# Altium project monitor_panel.PrjPcb
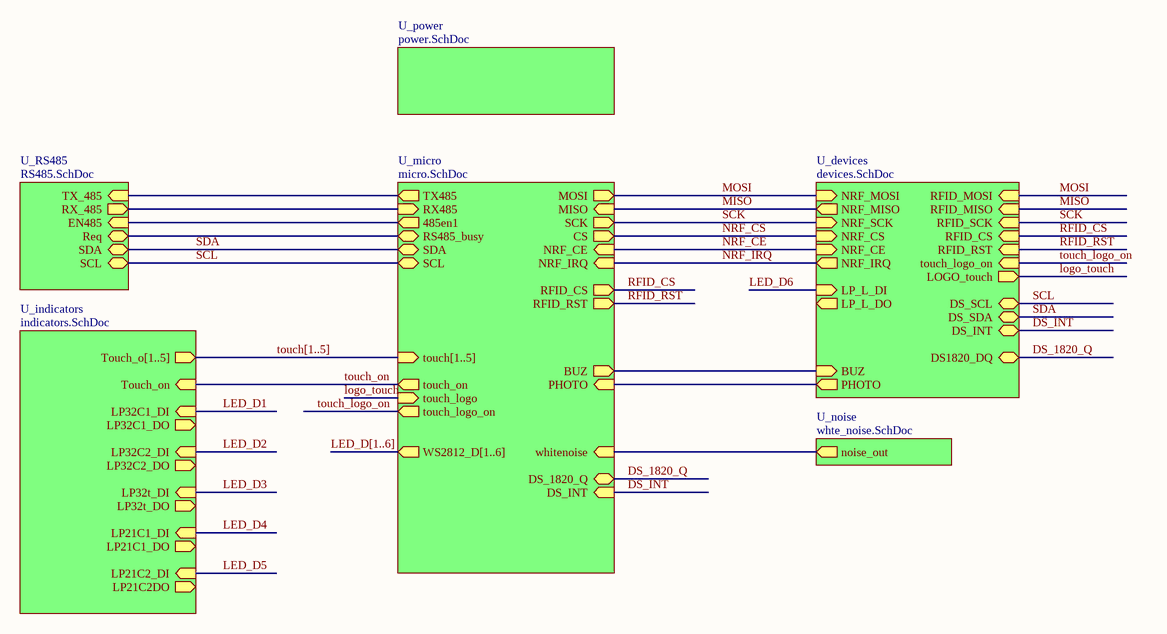
[diagram p0: top.SchDoc]
10 sheets, 211 parts. Net scope: hierarchical (ports join the sheet entries above them; power ports are global).
Board file: monitor_panel.PcbDoc
Sheets:
  top.SchDoc
    U_micro = micro.SchDoc
    U_devices = devices.SchDoc
    U_RS485 = RS485.SchDoc
    U_noise = whte_noise.SchDoc
    U_power = power.SchDoc
    U_indicators = indicators.SchDoc
      L1 = led_pack21.SchDoc
      L2 = led_pack21.SchDoc
      L3 = led_pack21.SchDoc
      L4 = led_pack21.SchDoc
      L5 = led_pack21.SchDoc
      L6 = led_pack21.SchDoc
      L7 = led_pack21.SchDoc
      L8 = led_pack21.SchDoc
      L9 = led_pack21.SchDoc
      L10 = led_pack21.SchDoc
      L11 = led_pack21.SchDoc
      L12 = led_pack21.SchDoc
      L13 = led_pack21.SchDoc
      L14 = led_pack21.SchDoc
      L15 = led_pack21.SchDoc
      M16 = led_pack32.SchDoc
      M17 = led_pack32.SchDoc
      M18 = led_pack32.SchDoc
      M19 = led_pack32.SchDoc
      M20 = led_pack32.SchDoc
      M21 = led_pack32.SchDoc
      M22 = led_pack32.SchDoc
      M23 = led_pack32.SchDoc
      M24 = led_pack32.SchDoc
      M25 = led_pack32.SchDoc
      T26 = led_pack32_touch.SchDoc
      T27 = led_pack32_touch.SchDoc
      T28 = led_pack32_touch.SchDoc
      T29 = led_pack32_touch.SchDoc
      T30 = led_pack32_touch.SchDoc

## Sheet top.SchDoc
size A4

### Sub-sheets
U_devices = devices.SchDoc: NRF_MISO (out), NRF_SCK (in), NRF_CE (in), NRF_IRQ (out), NRF_CS (in), NRF_MOSI (in), BUZ (in), PHOTO (out), DS_SCL (bidir), DS_SDA (bidir), DS_INT (bidir), DS1820_DQ (bidir), LOGO_touch (out), RFID_CS (in), RFID_MISO (in), RFID_RST (in), RFID_SCK (in), RFID_MOSI (in), LP_L_DI (in), LP_L_DO (out), touch_logo_on (in)
U_indicators = indicators.SchDoc: LP32C1_DI (in), LP21C1_DI (in), Touch_o[1..5] (out), LP32t_DO (out), LP32t_DI (in), LP32C1_DO (out), LP21C1_DO (out), Touch_on (in), LP21C2DO (out), LP32C2_DO (out), LP32C2_DI (in), LP21C2_DI (in)
U_micro = micro.SchDoc: whitenoise (in), SCL (bidir), SDA (bidir), RX485 (in), TX485 (out), 485en1 (out), RS485_busy (bidir), MOSI (out), MISO (in), SCK (out), CS (out), DS_INT (in), PHOTO (in), touch[1..5] (in), NRF_CE (in), NRF_IRQ (in), DS_1820_Q (bidir), BUZ (out), touch_on (out), touch_logo (in), WS2812_D[1..6] (out), RFID_CS (out), RFID_RST (out), touch_logo_on (out)
U_noise = whte_noise.SchDoc: noise_out (out)
U_power = power.SchDoc: no entries
U_RS485 = RS485.SchDoc: RX_485 (out), EN485 (in), TX_485 (in), Req (bidir), SDA (bidir), SCL (bidir)

### Nets
485en: sheet U_micro/485en1, sheet U_RS485/EN485
DS_1820_Q: sheet U_micro/DS_1820_Q, sheet U_devices/DS1820_DQ
DS_INT: sheet U_micro/DS_INT, sheet U_devices/DS_INT
logo_touch: sheet U_micro/touch_logo, sheet U_devices/LOGO_touch
MISO: sheet U_micro/MISO, sheet U_devices/NRF_MISO, sheet U_devices/RFID_MISO
MOSI: sheet U_micro/MOSI, sheet U_devices/NRF_MOSI, sheet U_devices/RFID_MOSI
NRF_CE: sheet U_micro/NRF_CE, sheet U_devices/NRF_CE
NRF_CS: sheet U_micro/CS, sheet U_devices/NRF_CS  [project net CS]
NRF_IRQ: sheet U_micro/NRF_IRQ, sheet U_devices/NRF_IRQ
photo: sheet U_micro/PHOTO, sheet U_devices/PHOTO
RFID_CS: sheet U_micro/RFID_CS, sheet U_devices/RFID_CS
RFID_RST: sheet U_micro/RFID_RST, sheet U_devices/RFID_RST
RS48_busy: sheet U_micro/RS485_busy, sheet U_RS485/Req
RX485: sheet U_micro/RX485, sheet U_RS485/RX_485
SCK: sheet U_micro/SCK, sheet U_devices/NRF_SCK, sheet U_devices/RFID_SCK
SCL: sheet U_micro/SCL, sheet U_devices/DS_SCL, sheet U_RS485/SCL
SDA: sheet U_micro/SDA, sheet U_devices/DS_SDA, sheet U_RS485/SDA
touch_logo_on: sheet U_micro/touch_logo_on, sheet U_devices/touch_logo_on
touch_on: sheet U_micro/touch_on, sheet U_indicators/Touch_on
TX485: sheet U_micro/TX485, sheet U_RS485/TX_485
whitenoise: sheet U_micro/whitenoise, sheet U_noise/noise_out
NetSP1_1: sheet U_micro/BUZ, sheet U_devices/BUZ

### Buses and harness runs
bus LED_D[1..6] = sheet U_micro/WS2812_D[1..6]
bus touch[1..5] = sheet U_indicators/Touch_o[1..5] = sheet U_micro/touch[1..5]

## Sheet micro.SchDoc
size A3
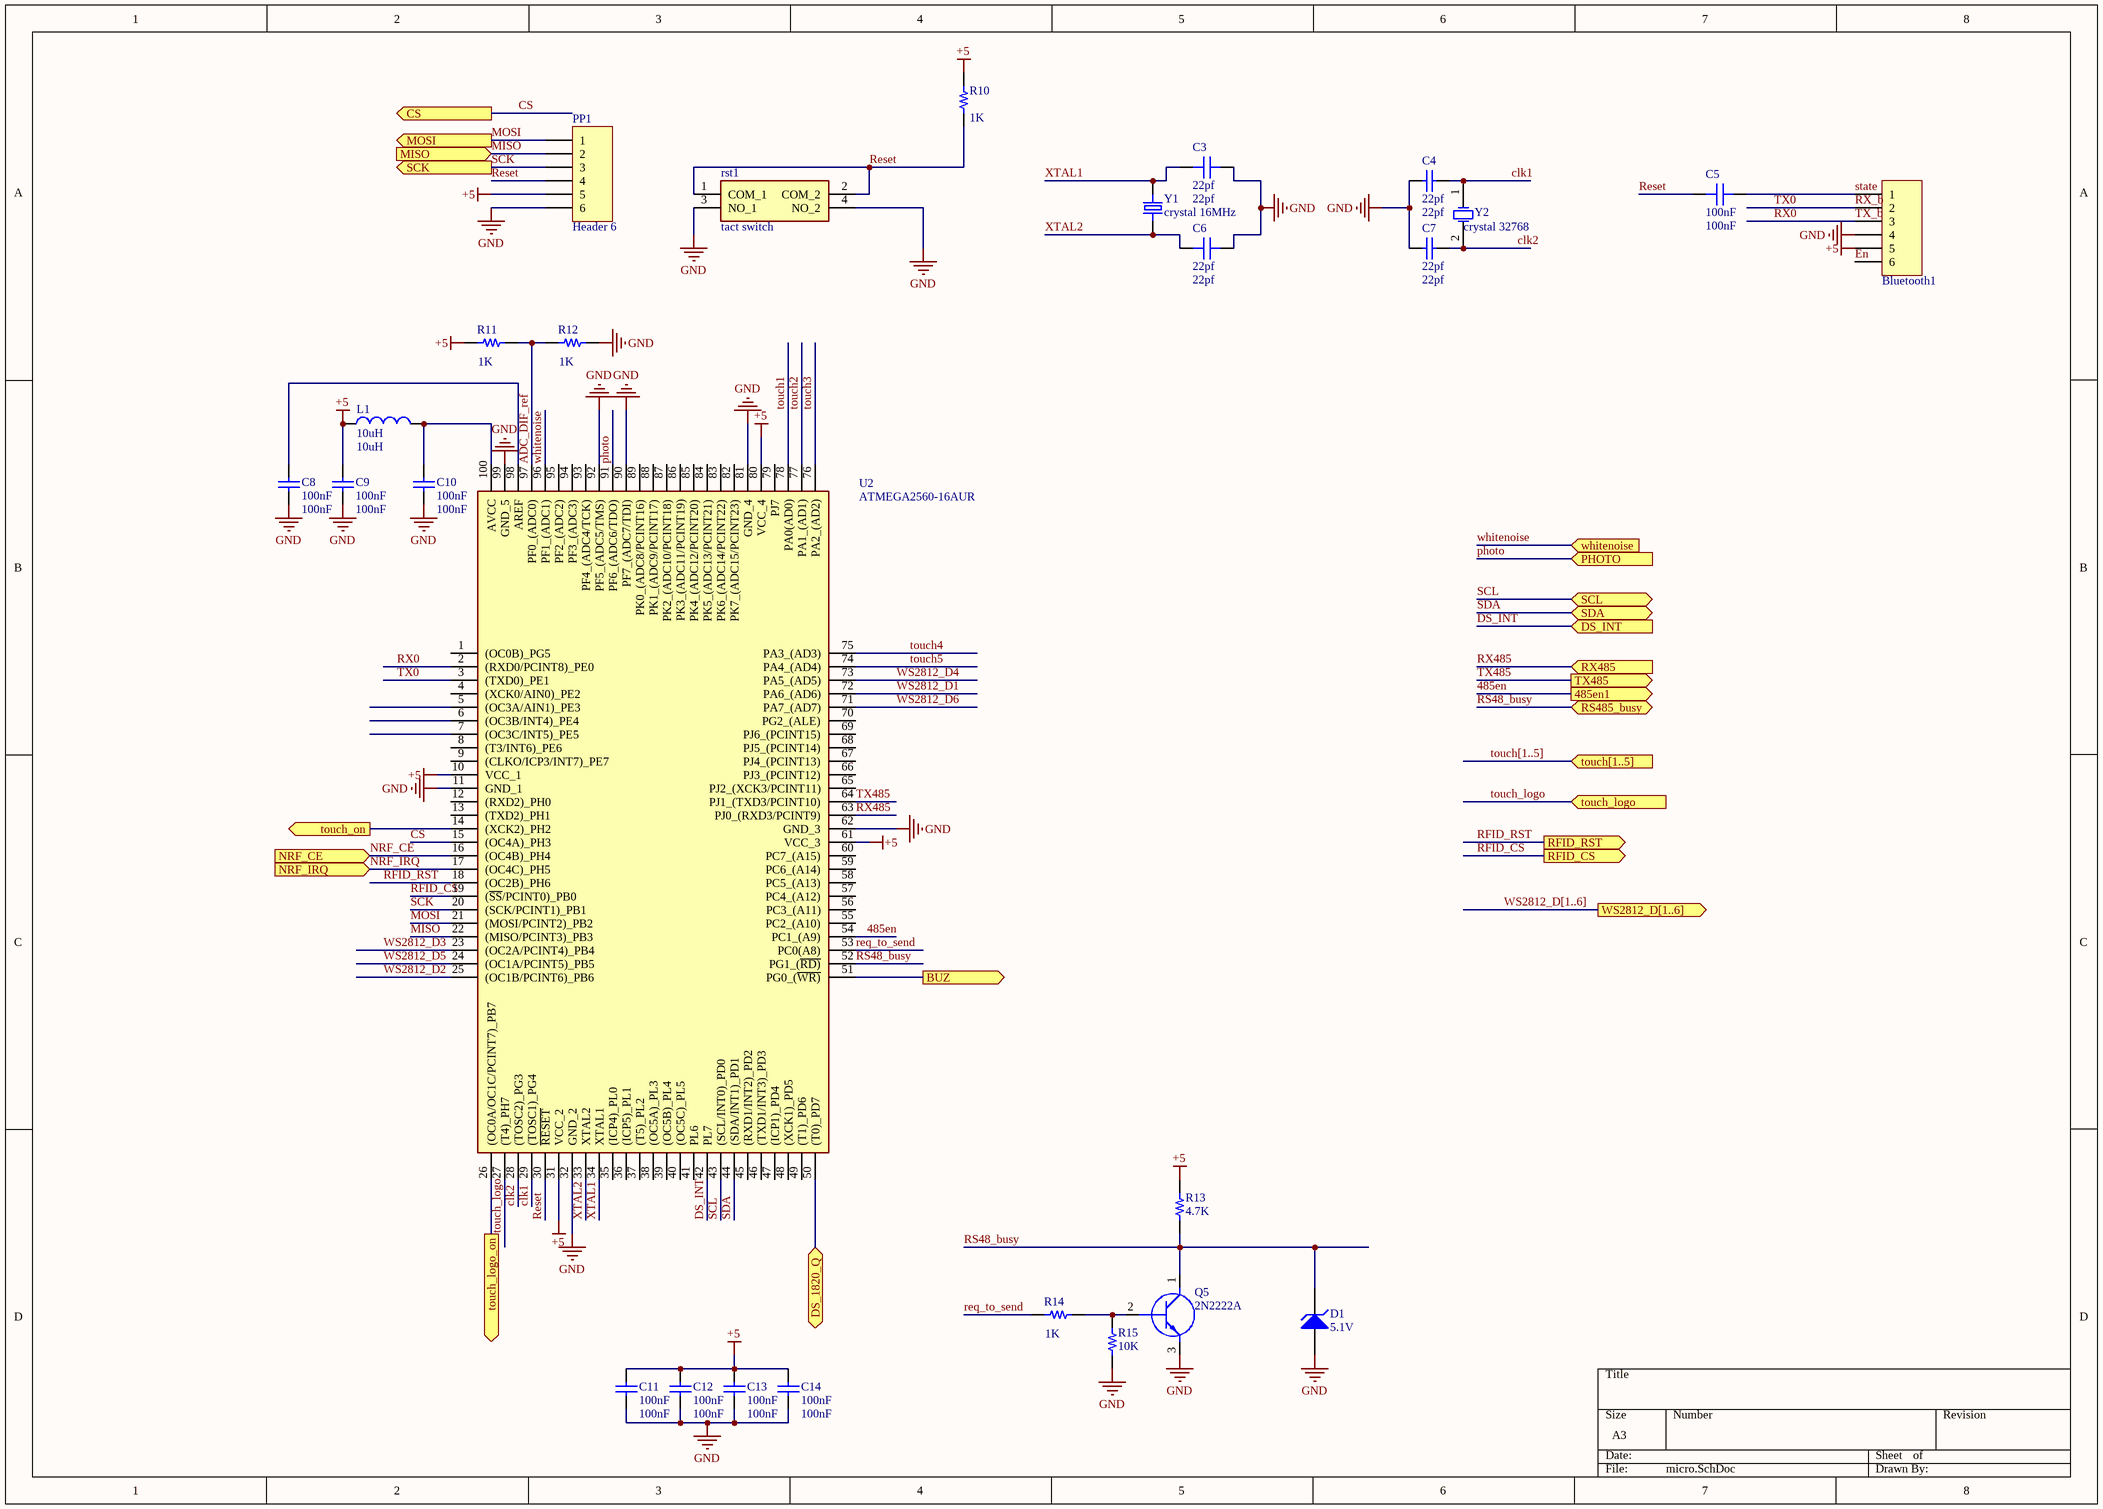
[diagram p1: micro.SchDoc]

### Parts
Bluetooth1  Header 6  [H-1x6]  (value not drawn)
C3  22pf  [0603C]
C4  22pf  [0603C]
C5  100nF  [0603C]
C6  22pf  [0603C]
C7  22pf  [0603C]
C8  100nF  [0603C]
C9  100nF  [0603C]
C10  100nF  [0603C]
C11  100nF  [0603C]
C12  100nF  [0603C]
C13  100nF  [0603C]
C14  100nF  [0603C]
D1  5.1V  [Diode 1n4148 SMD]
L1  10uH  [IND1206]
PP1  Header 6  [HDR1X6]
Q5  2N2222A  [soT95p280x130-3n]
R10  1K  [0603R]
R11  1K  [0603R]
R12  1K  [0603R]
R13  4.7K  [0603R]
R14  1K  [0603R]
R15  10K  [0603R]
rst1  tact switch  [DTSM63NVB]
U2  ATMEGA2560-16AUR  [QFP50P1600X1600X120-100N]
Y1  crystal 16MHz  [XTAL_ECS-180-S-5P-DN-TR]
Y2  crystal 32768  [XTAL RTC]

### Ports
485en1 (out), BUZ (out), CS (out), DS_1820_Q (bidir), DS_INT (in), MISO (in), MOSI (out), NRF_CE (in), NRF_IRQ (in), PHOTO (in), RFID_CS (out), RFID_RST (out), RS485_busy (bidir), RX485 (in), SCK (out), SCL (bidir), SDA (bidir), touch[1..5] (in), touch_logo (in), touch_logo_on (out), touch_on (out), TX485 (out), whitenoise (in), WS2812_D[1..6] (out)

### Nets
+5: Bluetooth1.5 C9.1 C11.1 C12.1 C13.1 C14.1 L1.1 PP1.5 R10.2 R11.2 R13.1 U2.10(VCC_1) U2.31(VCC_2) U2.61(VCC_3) U2.80(VCC_4)
GND: Bluetooth1.4 C3.1 C4.1 C6.1 C7.2 C8.2 C9.2 C10.2 C11.2 C12.2 C13.2 C14.2 D1.1(A) PP1.6 Q5.3(E) R12.1 R15.2 rst1.3(NO_1) rst1.4(NO_2) U2.11(GND_1) U2.32(GND_2) U2.62(GND_3) U2.81(GND_4) U2.90(PF7_(ADC7/TDI)) U2.92(PF5_(ADC5/TMS)) U2.99(GND_5)
485en: U2.54(PC1_(A9)) ; port 485en1
ADC_DIF_ref: R11.1 R12.2 U2.97(PF0_(ADC0))
clk1: C4.2 U2.29((TOSC1)_PG4) Y2.1(OSC1)
clk2: C7.1 U2.28((TOSC2)_PG3) Y2.2(OSC2)
CS: U2.15((OC4A)_PH3) ; port CS
DS_1820_Q: U2.50((T0)_PD7) ; port DS_1820_Q
DS_INT: U2.42(PL7) ; port DS_INT
En: Bluetooth1.6
MISO: PP1.2 U2.22((MISO/PCINT3)_PB3) ; port MISO
MOSI: PP1.1 U2.21((MOSI/PCINT2)_PB2) ; port MOSI
NRF_CE: U2.16((OC4B)_PH4) ; port NRF_CE
NRF_IRQ: U2.17((OC4C)_PH5) ; port NRF_IRQ
photo: U2.91(PF6_(ADC6/TDO)) ; port PHOTO
req_to_send: R14.2 U2.53(PC0(A8))
Reset: C5.2 PP1.4 R10.1 rst1.1(COM_1) rst1.2(COM_2) U2.30(~{RESET})
RFID_CS: U2.19((~{SS}/PCINT0)_PB0) ; port RFID_CS
RFID_RST: U2.18((OC2B)_PH6) ; port RFID_RST
RS48_busy: D1.2(K) Q5.1(C) R13.2 U2.52(PG1_(~{RD)}) ; port RS485_busy
RX0: Bluetooth1.3 U2.2((RXD0/PCINT8)_PE0)  [also labelled TX_b]
RX485: U2.63(PJ0_(RXD3/PCINT9)) ; port RX485
RX_b: Bluetooth1.2 U2.3((TXD0)_PE1)  [also labelled TX0]
SCK: PP1.3 U2.20((SCK/PCINT1)_PB1) ; port SCK
SCL: U2.43((SCL/INT0)_PD0) ; port SCL
SDA: U2.44((SDA/INT1)_PD1) ; port SDA
state: Bluetooth1.1 C5.1
touch1: U2.78(PA0(AD0))
touch2: U2.77(PA1_(AD1))
touch3: U2.76(PA2_(AD2))
touch4: U2.75(PA3_(AD3))
touch5: U2.74(PA4_(AD4))
touch_logo: U2.27((T4)_PH7) ; port touch_logo  [project net logo_touch]
touch_logo_on: U2.26((OC0A/OC1C/PCINT7)_PB7) ; port touch_logo_on
touch_on: U2.14((XCK2)_PH2) ; port touch_on
TX485: U2.64(PJ1_(TXD3/PCINT10)) ; port TX485
whitenoise: U2.96(PF1_(ADC1)) ; port whitenoise
WS2812_D1: U2.72(PA6_(AD6))  [project net LED_D1]
WS2812_D2: U2.25((OC1B/PCINT6)_PB6)  [project net LED_D2]
WS2812_D3: U2.23((OC2A/PCINT4)_PB4)  [project net LED_D3]
WS2812_D4: U2.73(PA5_(AD5))  [project net LED_D4]
WS2812_D5: U2.24((OC1A/PCINT5)_PB5)  [project net LED_D5]
WS2812_D6: U2.71(PA7_(AD7))  [project net LED_D6]
XTAL1: C3.2 U2.34(XTAL1) Y1.2
XTAL2: C6.2 U2.33(XTAL2) Y1.1
NetC8_1: C8.1 U2.98(AREF)
NetC10_1: C10.1 L1.2 U2.100(AVCC)
NetQ5_2: Q5.2(B) R14.1 R15.1
NetSP1_1: U2.51(PG0_(~{WR)}) ; port BUZ

Not connected (* = marked no-connect by the designer): U2 1((OC0B)_PG5) 4((XCK0/AIN0)_PE2) 5((OC3A/AIN1)_PE3) 6((OC3B/INT4)_PE4) 7((OC3C/INT5)_PE5) 8((T3/INT6)_PE6) 9((CLKO/ICP3/INT7)_PE7) 12((RXD2)_PH0) 13((TXD2)_PH1) 35((ICP4)_PL0) 36((ICP5)_PL1) 37((T5)_PL2) 38((OC5A)_PL3) 39((OC5B)_PL4) 40((OC5C)_PL5) 41(PL6) 45((RXD1/INT2)_PD2) 46((TXD1/INT3)_PD3) 47((ICP1)_PD4) 48((XCK1)_PD5) 49((T1)_PD6) 55(PC2_(A10)) 56(PC3_(A11)) 57(PC4_(A12)) 58(PC5_(A13)) 59(PC6_(A14)) 60(PC7_(A15)) 65(PJ2_(XCK3/PCINT11)) 66(PJ3_(PCINT12)) 67(PJ4_(PCINT13)) 68(PJ5_(PCINT14)) 69(PJ6_(PCINT15)) 70(PG2_(ALE)) 79(PJ7) 82(PK7_(ADC15/PCINT23)) 83(PK6_(ADC14/PCINT22)) 84(PK5_(ADC13/PCINT21)) 85(PK4_(ADC12/PCINT20)) 86(PK3_(ADC11/PCINT19)) 87(PK2_(ADC10/PCINT18)) 88(PK1_(ADC9/PCINT17)) 89(PK0_(ADC8/PCINT16)) 93(PF4_(ADC4/TCK)) 94(PF3_(ADC3)) 95(PF2_(ADC2))

### Buses and harness runs
bus touch[1..5] = port touch[1..5]
bus WS2812_D[1..6] = port WS2812_D[1..6]

### Library data of the parts
Bluetooth1 = H-1x6: Header, 6-Pin , female
C3 C5 C6 = Capacitor: CAP SMD 0603; Part Number: C0805X106K9RAC7800
  C3 C6: Value: 22pf
  C5: Value: 100nF
C4 C7-C14 = Cap: CAP SMD 0603; Published: 8-Jun-2000; LatestRevisionDate: 17-Jul-2002; LatestRevisionNote: Re-released for DXP Platform.; PackageReference: RAD-0.3; Publisher: Altium Limited; PackageDescription: Radial Cap, Thru-Hole; 2 Leads; 0.3 in Pin Spacing
  C4 C7: Value: 22pf
  C8-C14: Value: 100nF
D1 = D Zener: Zener Diode 5.1v; Published: 8-Jun-2000; LatestRevisionDate: 17-Jul-2002; LatestRevisionNote: Re-released for DXP Platform.; PackageReference: DIODE-0.7; Publisher: Altium Limited; PackageDescription: Diode, Thru-Hole; 2 Leads; 0.7 in Pin Spacing
L1 = Inductor: Inductor 1206; Code_IEC: 1005; Published: 8-Jun-2000; LatestRevisionDate: 29-May-2009; LatestRevisionNote: IPC-7351 Footprint Added.; PackageReference: 0402-A; Publisher: Altium Limited; PackageDescription: Chip Inductor; Code_JEITA: 0402; Value: 10uH
PP1 = Header 6: Header, 6-Pin , female; LatestRevisionDate: 17-Jul-2002; LatestRevisionNote: Re-released for DXP Platform.; Publisher: Altium Limited
Q5 = 2N2222A: Transistor BJT NPN SMD; pin to pad: 1>3 2>1 3>2; Manufacturer_Name: Foshan Blue Rocket Elec; Datasheet Link: https://datasheet.lcsc.com/szlcsc/1901291437_Foshan-Blue-Rocket-Elec-2N2222A_C358533.pdf; Height: 4.7mm; Manufacturer_Part_Number: 2N2222A
R10-R15 = Resistor: RES SMD 0603; Part Number: RCS0805100KFKEA
  R10-R12 R14: Value: 1K
  R13: Value: 4.7K
  R15: Value: 10K
rst1 = DTSM-66R-V-T_R: Push Button SMD - 4PIN; Manufacturer_Name: Diptronics; Manufacturer_Part_Number: DTSM-66R-V-T/R; Datasheet Link: https://www.mouser.co.uk/datasheet/2/910/464_DTSMJ-6-1571536.pdf; Height: 7.1mm; Mouser Part Number: 113-DTSM66RVTR; Mouser Price/Stock: https://www.mouser.co.uk/ProductDetail/Diptronics/DTSM-66R-V-T-R?qs=MLItCLRbWsxl2%252BVY862AIw%3D%3D
U2 = ATMEGA2560-16AUR: ATMEGA2560-LQFP100; Manufacturer_Name: Microchip; Datasheet Link: http://ww1.microchip.com/downloads/en/DeviceDoc/Atmel-2549-8-bit-AVR-Microcontroller-ATmega640-1280-1281-2560-2561_datasheet.pdf; Height: 1.2mm; Manufacturer_Part_Number: ATMEGA2560-16AUR; Mouser Part Number: 556-ATMEGA2560-16AUR; Mouser Price/Stock: https://www.mouser.co.uk/ProductDetail/Microchip-Technology-Atmel/ATMEGA2560-16AUR?qs=6Dg1WZIWLC5tcX5fO8xzXQ%3D%3D; Arrow Part Number: ATMEGA2560-16AUR; Arrow Price/Stock: https://www.arrow.com/en/products/atmega2560-16aur/microchip-technology?region=nac
Y1 = ECS-180-S-5P-DN-TR: Crystals 16MHz; MF: ECS International; MP: ECS-180-S-5P-DN-TR; Value: 16MHz; SnapEDA_Link: https://www.snapeda.com/parts/ECS-180-S-5P-DN-TR/ECS%20International/view-part/2547669/?ref=snap; Price: None; Package: HC49/US ECS International; Availability: Unavailable
Y2 = XTAL: RTC crystal; Company: E.P.I.L; Value: 32768; Design Date: 11/04/2011

## Sheet devices.SchDoc
size A3
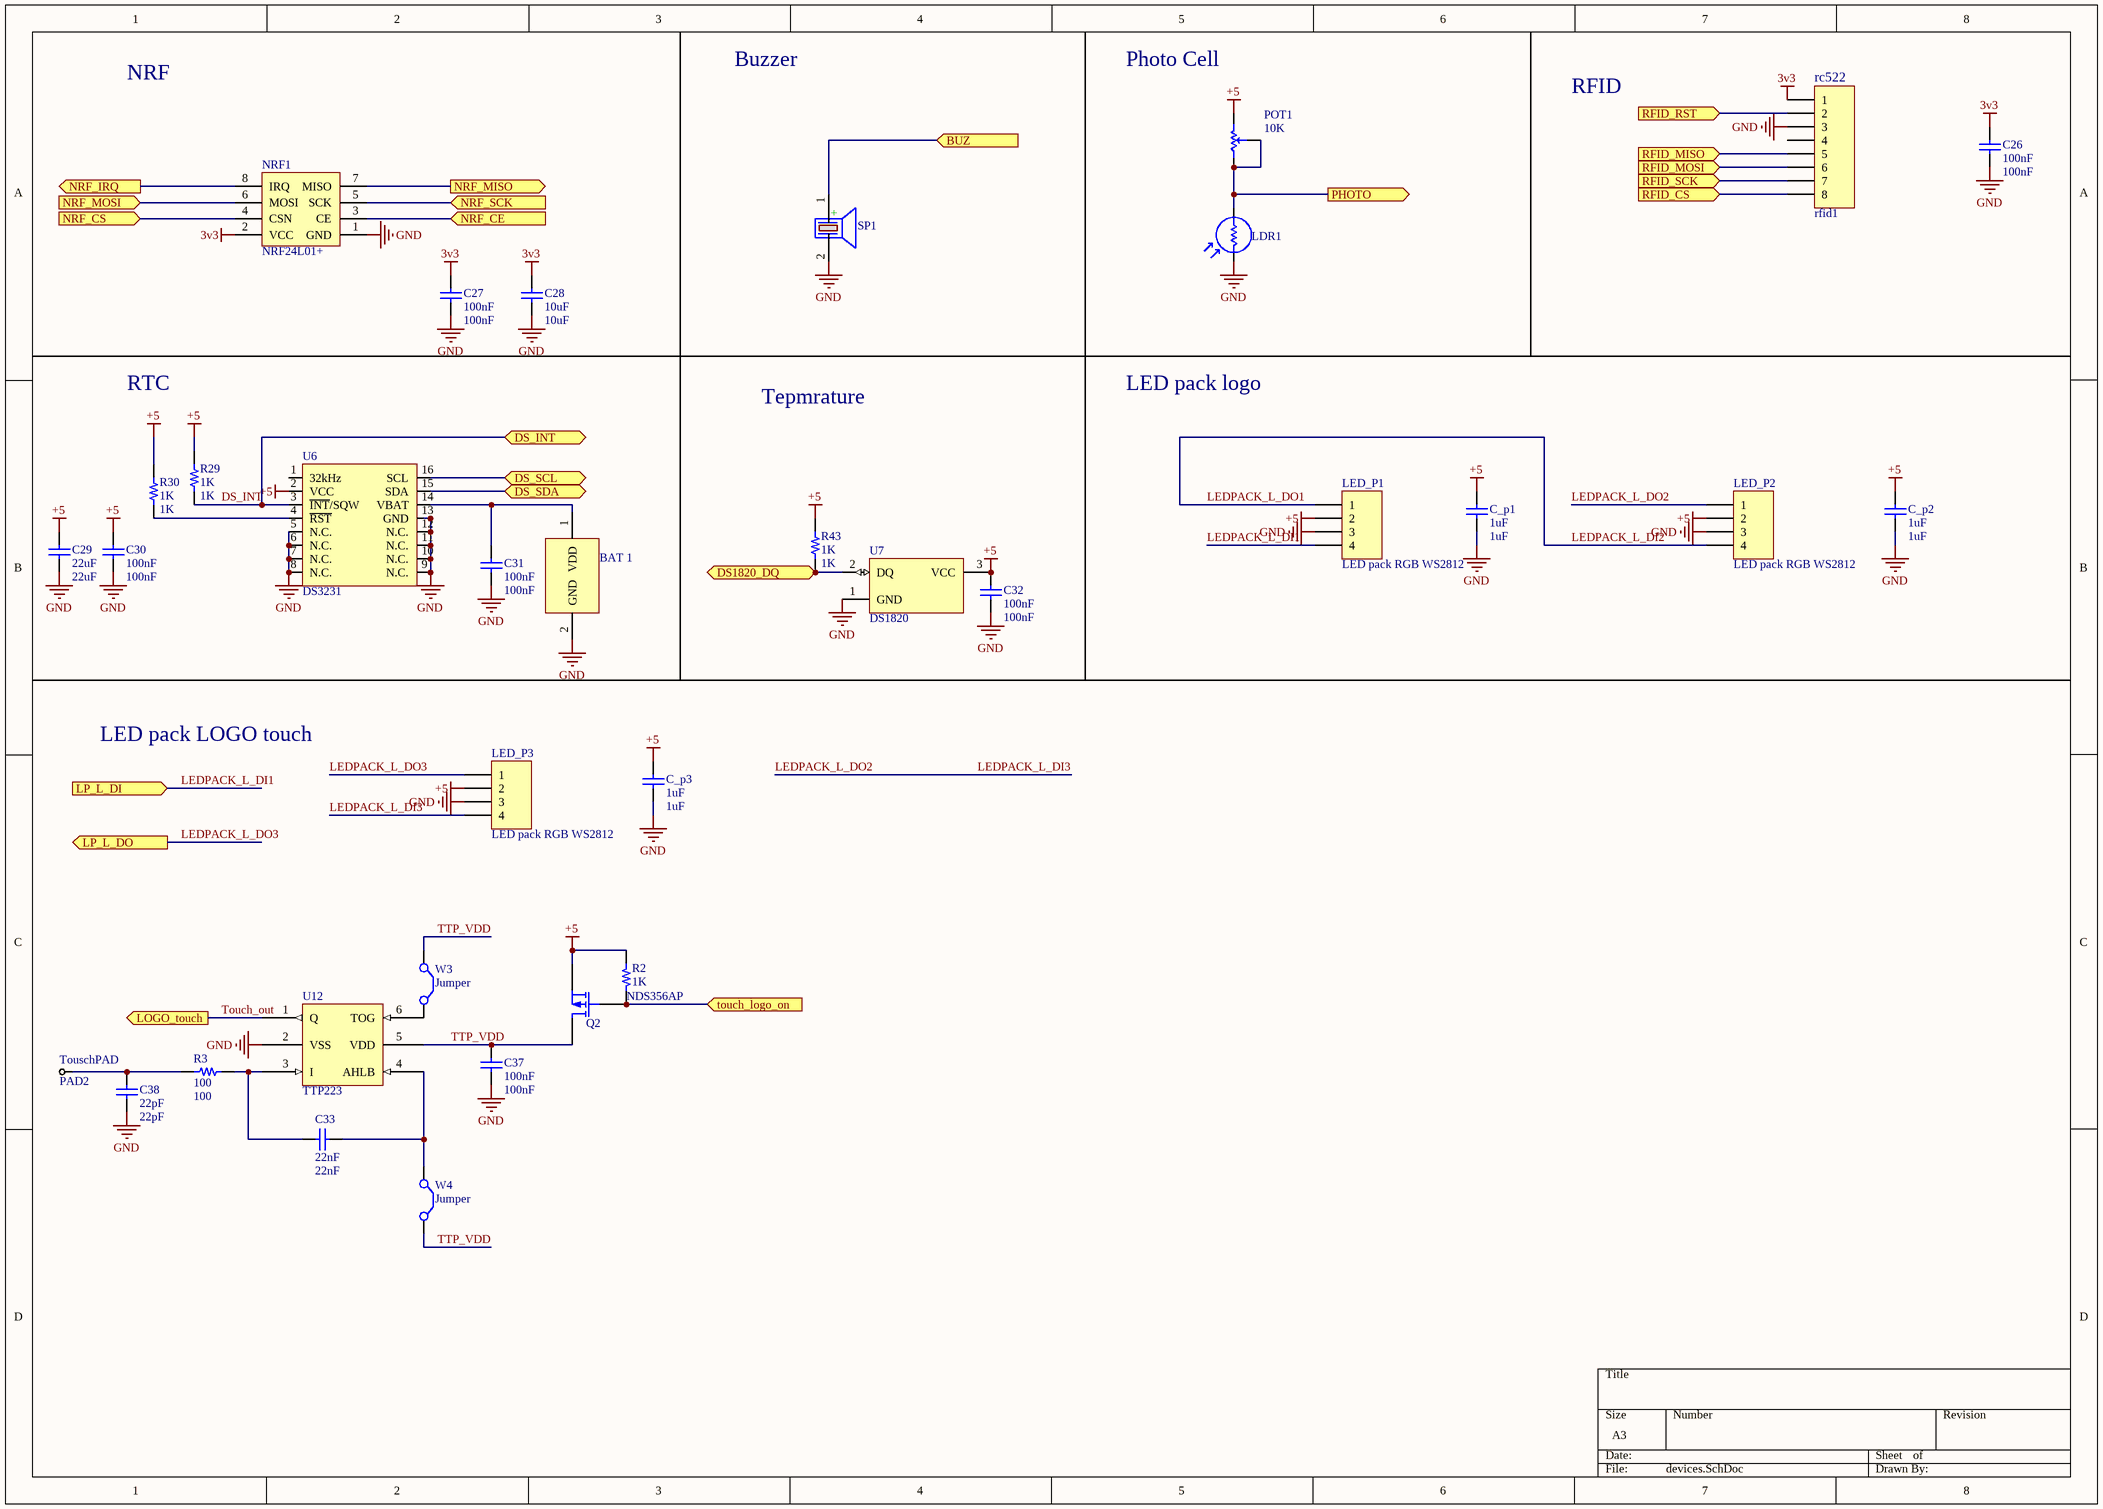
[diagram p2: devices.SchDoc]

### Parts
BAT_1  BAT Backup  [BATTERY_coin]  (value not drawn)
C26  100nF  [0603C]
C27  100nF  [0603C]
C28  10uF  [0603C]
C29  22uF  [0603C]
C30  100nF  [0603C]
C31  100nF  [0603C]
C32  100nF  [0603C]
C33  22nF  [0603C]
C37  100nF  [0603C]
C38  22pF  [0603C]
C_p1  1uF  [0603C]
C_p2  1uF  [0603C]
C_p3  1uF  [0603C]
LDR1  PhotoCell-5mm  [PhotoCell]  (value not drawn)
LED_P1  LED pack RGB WS2812  [PACK77-2121]  (no BOM)
LED_P2  LED pack RGB WS2812  [PACK95.4-2121]  (no BOM)
LED_P3  LED pack RGB WS2812  [pack21-2121]  (no BOM)
NRF1  NRF24L01+  [NRF24L01P]
PAD2  TouschPAD  [touchPAD3]  (no BOM)
POT1  10K  [POT 2]
Q2  NDS356AP  [soT95p280x130-3n]
R2  1K  [0603R]
R3  100  [0603R]
R29  1K  [0603R]
R30  1K  [0603R]
R43  1K  [0603R]
rfid1  H-1x8  [RCC522-rfID-2]  (value not drawn)
SP1  BUZZER  [BUZZER 7.62mm DC]  (value not drawn)
U6  DS3231  [SO-16W]
U7  DS1820  [DS1820]
U12  TTP223  [SOT23-6_L]
W3  Jumper  [JUMPER]  (no BOM)
W4  Jumper  [JUMPER]  (no BOM)

### Ports
BUZ (in), DS1820_DQ (bidir), DS_INT (bidir), DS_SCL (bidir), DS_SDA (bidir), LOGO_touch (out), LP_L_DI (in), LP_L_DO (out), NRF_CE (in), NRF_CS (in), NRF_IRQ (out), NRF_MISO (out), NRF_MOSI (in), NRF_SCK (in), PHOTO (out), RFID_CS (in), RFID_MISO (in), RFID_MOSI (in), RFID_RST (in), RFID_SCK (in), touch_logo_on (in)

### Nets
3v3: C26.2 C27.2 C28.2 NRF1.2(VCC) rfid1.1
+5: C29.2 C30.2 C32.2 C_p1.2 C_p2.2 C_p3.2 LED_P1.2 LED_P2.2 LED_P3.2 POT1.2(CW) Q2.3(S) R2.1 R29.2 R30.2 R43.2 U6.2(VCC) U7.3(VCC)
GND: BAT_1.2(GND) C26.1 C27.1 C28.1 C29.1 C30.1 C31.1 C32.1 C37.1 C38.1 C_p1.1 C_p2.1 C_p3.1 LDR1.1 LED_P1.3 LED_P2.3 LED_P3.3 NRF1.1(GND) rfid1.3 SP1.2(-) U6.5(N.C.) U6.6(N.C.) U6.7(N.C.) U6.8(N.C.) U6.9(N.C.) U6.10(N.C.) U6.11(N.C.) U6.12(N.C.) U6.13(GND) U7.1(GND) U12.2(VSS)
CS: NRF1.4(CSN) ; port NRF_CS
DS_1820_Q: R43.1 U7.2(DQ) ; port DS1820_DQ
DS_INT: R29.1 U6.3(~{INT}/SQW) ; port DS_INT
LEDPACK_L_DI1: LED_P1.4 ; port LP_L_DI  [project net LED_D6]
LEDPACK_L_DI2: LED_P1.1 LED_P2.4  [also labelled LEDPACK_L_DO1]
LEDPACK_L_DI3: LED_P2.1 LED_P3.4  [also labelled LEDPACK_L_DO2]
LEDPACK_L_DO3: LED_P3.1 ; port LP_L_DO
MISO: NRF1.7(MISO) rfid1.5 ; port NRF_MISO, port RFID_MISO
MOSI: NRF1.6(MOSI) rfid1.6 ; port NRF_MOSI, port RFID_MOSI
NRF_CE: NRF1.3(CE) ; port NRF_CE
NRF_IRQ: NRF1.8(IRQ) ; port NRF_IRQ
photo: LDR1.2 POT1.1(CCW) POT1.3(SetPoint) ; port PHOTO
RFID_CS: rfid1.8 ; port RFID_CS
RFID_RST: rfid1.2 ; port RFID_RST
SCK: NRF1.5(SCK) rfid1.7 ; port NRF_SCK, port RFID_SCK
SCL: U6.16(SCL) ; port DS_SCL
SDA: U6.15(SDA) ; port DS_SDA
touch_logo_on: Q2.2(G) R2.2 ; port touch_logo_on
Touch_out: U12.1(Q) ; port LOGO_touch  [project net logo_touch]
TTP_VDD: C37.2 Q2.1(D) U12.5(VDD) W3.1(C1) W4.2(C2)
NetBAT_1_1: BAT_1.1(VDD) C31.2 U6.14(VBAT)
NetC33_1: C33.1 U12.4(AHLB) W4.1(C1)
NetC33_2: C33.2 R3.1 U12.3(I)
NetC38_2: C38.2 PAD2.1(T) R3.2
NetR30_1: R30.1 U6.4(~{RST})
NetSP1_1: SP1.1(+) ; port BUZ
NetU12_6: U12.6(TOG) W3.2(C2)

Not connected (* = marked no-connect by the designer): rfid1 4; U6 1(32kHz)

### Notes on the sheet
- NRF
- Buzzer
- Photo Cell
- RFID
- (near rfid1) rc522
- RTC
- Tepmrature
- LED pack logo
- LED pack LOGO touch

### Library data of the parts
BAT_1 = BAT Backup: COIN CELL BATTERY CR1220
C26-C32 C37 C_p1-C_p3 = Cap: CAP SMD 0603; Published: 8-Jun-2000; LatestRevisionDate: 17-Jul-2002; LatestRevisionNote: Re-released for DXP Platform.; PackageReference: RAD-0.3; Publisher: Altium Limited; PackageDescription: Radial Cap, Thru-Hole; 2 Leads; 0.3 in Pin Spacing
  C26 C27 C30-C32 C37: Value: 100nF
  C28: Value: 10uF
  C29: Value: 22uF
  C_p1-C_p3: Value: 1uF
C33 C38 = Cap: X7R_NPO; Published: 8-Jun-2000; LatestRevisionDate: 17-Jul-2002; LatestRevisionNote: Re-released for DXP Platform.; PackageReference: RAD-0.3; Publisher: Altium Limited; PackageDescription: Radial Cap, Thru-Hole; 2 Leads; 0.3 in Pin Spacing
  C33: Value: 22nF
  C38: Value: 22pF
LDR1 = LDR: Photo Cell- Variable Resistor With Light; Company: IPA CO.; Designer: Saeid Jorablo; Last Update Time: 2008/07/17
LED_P1 = Header 4: 19RGB LED pack; LatestRevisionDate: 17-Jul-2002; LatestRevisionNote: Re-released for DXP Platform.; Publisher: Altium Limited
LED_P2 = Header 4: 23 RGB LED pack; LatestRevisionDate: 17-Jul-2002; LatestRevisionNote: Re-released for DXP Platform.; Publisher: Altium Limited
LED_P3 = Header 4: 5 RGB LED pack; LatestRevisionDate: 17-Jul-2002; LatestRevisionNote: Re-released for DXP Platform.; Publisher: Altium Limited
NRF1 = NRF24L01P: NRF Module; Ali Hafizi: Creature
PAD2 = Test Point
POT1 = POT: Variable Resistor; Value: 10K
Q2 = MOSFET-P: P-Channel MOSFET SOT23; pin to pad: 1>3 2>1 3>2; Published: 8-Jun-2000; LatestRevisionDate: 17-Jul-2002; LatestRevisionNote: Re-released for DXP Platform.; PackageVersion: 1995/1996; PackageReference: E3; Publisher: Altium Limited; PackageDescription: TO, Flat Index; 3 In-Line, Axial Leads; Body Dia. 4.6mm; Lead Dia. 0.5 mm (max)
R2 R3 R29 R30 R43 = Resistor: as R10 on sheet micro
  R2 R29 R30 R43: Value: 1K
  R3: Value: 100
SP1 = PIEZO BUZZER: PIEZO BUZZER 5VOLTS; Designer: Abbas Basereh; Comment_1: SPEAKER AND BEEP; Design Date: 1395/11/14; ComponentLink2Description: Reference; PackageDescription: THD; Publisher: Abbas Basereh; Mounting Technology: THD; Pin Count: 2; Status: Unreleased
U6 = DS3231: DS3231 RTC
U7 = DS1820: 1-Wire Digital Thermometer; ComponentAvailability: Obsolete; Published: 13-Oct-2000; LatestRevisionDate: 17-Jul-2002; LatestRevisionNote: Re-released for DXP Platform.; DatasheetVersion: 5-Mar-1998; PackageVersion: 1999; PackageReference: PR35; Publisher: Altium Limited; PackageDescription: TO, Flat Index; 3 In-Line, Axial Leads; Body Dia. 4.6mm; Leads 0.56 x 0.51 mm (max); ComponentLink1Description: Manufacturer Link; ComponentLink1URL: http://www.maxim-ic.com/; ComponentLink2Description: Datasheet; ComponentLink2URL: http://pdfserv.maxim-ic.com/en/ds/DS1820-DS1820S.pdf; ComponentLink3Description: Discontinuation Notice; ComponentLink3URL: http://www.maxim-ic.com/qa/pdfs/non-obsolescence-letter.pdf
U12 = ttp223b: capacitive touch IC
W3 W4 = Jumper: Jumper Wire; Published: 24-Mar-1999; LatestRevisionDate: 17-Jul-2002; LatestRevisionNote: Re-released for DXP Platform.; PackageReference: RAD-0.2; Publisher: Altium Limited; PackageDescription: Radial Cap, Thru-Hole; 2 Leads; 0.2 in Pin Spacing

## Sheet RS485.SchDoc
size A4
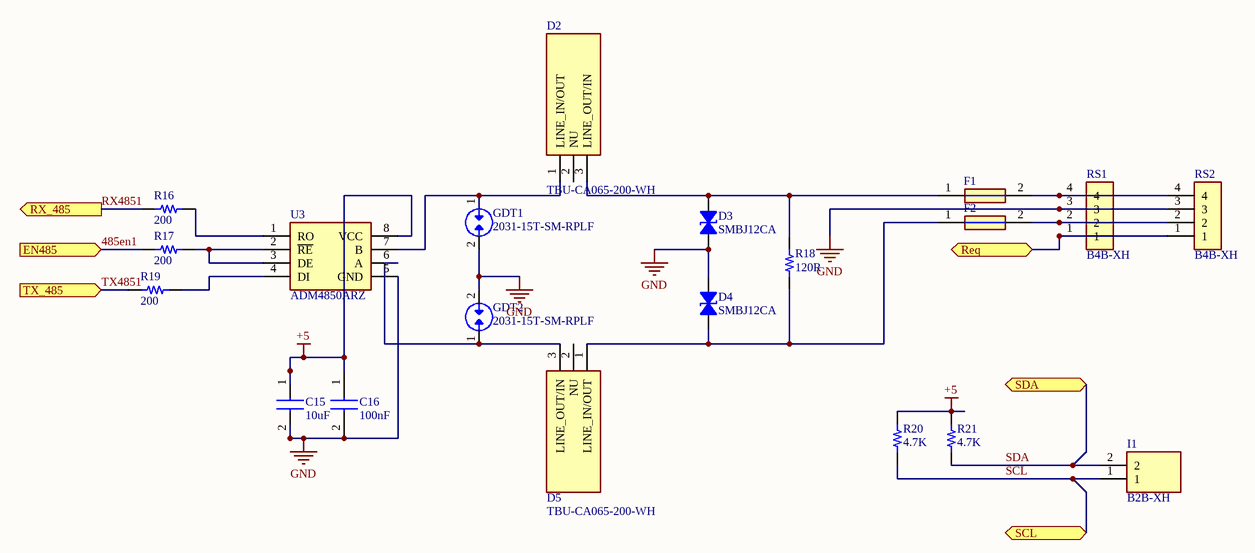
[diagram p3: RS485.SchDoc]

### Parts
C15  10uF  [0603C]
C16  100nF  [0603C]
D2  TBU-CA065-200-WH  [TBUCA025050WH]
D3  SMBJ12CA  [DO214AA SMB]
D4  SMBJ12CA  [DO214AA SMB]
D5  TBU-CA065-200-WH  [TBUCA025050WH]
F1  fuse 100mAmp  [1206 FUSE]  (value not drawn)
F2  fuse 100mAmp  [1206 FUSE]  (value not drawn)
GDT1  2031-15T-SM-RPLF  [TVS_2031-15T-SM-RPLF]
GDT2  2031-15T-SM-RPLF  [TVS_2031-15T-SM-RPLF]
I1  B2B-XH  [JST-B2B-XH]
R16  200  [0603R]
R17  200  [0603R]
R18  120R  [0603R]
R19  200  [0603R]
R20  4.7K  [0603R]
R21  4.7K  [0603R]
RS1  B4B-XH  [JST-B4B-XH]
RS2  B4B-XH  [JST-B4B-XH]
U3  ADM4850ARZ  [SO8_N]

### Ports
EN485 (in), Req (bidir), RX_485 (out), SCL (bidir), SDA (bidir), TX_485 (in)

### Nets
+5: C15.1 C16.1 R20.1 R21.1 U3.8(VCC)
GND: C15.2 C16.2 D3.1 D4.2 GDT1.2 GDT2.2 RS1.3 RS2.3 U3.5(GND)
485en1: R17.2 ; port EN485  [project net 485en]
RS48_busy: RS1.1 RS2.1 ; port Req
RX4851: R16.2 ; port RX_485  [project net RX485]
SCL: I1.1 R20.2 ; port SCL
SDA: I1.2 R21.2 ; port SDA
TX4851: R19.2 ; port TX_485  [project net TX485]
NetD2_1: D2.1(LINE_IN/OUT) GDT1.1 U3.7(B)
NetD2_3: D2.3(LINE_OUT/IN) D3.2 F1.1 R18.1
NetD4_1: D4.1 D5.1(LINE_IN/OUT) F2.1 R18.2
NetD5_3: D5.3(LINE_OUT/IN) GDT2.1 U3.6(A)
NetF1_2: F1.2 RS1.4 RS2.4
NetF2_2: F2.2 RS1.2 RS2.2
NetR16_1: R16.1 U3.1(RO)
NetR17_1: R17.1 U3.2(~{RE}) U3.3(DE)
NetR19_1: R19.1 U3.4(DI)

Not connected (* = marked no-connect by the designer): D2 2(NU); D5 2(NU)

### Library data of the parts
C15 C16 = C1206C104Z5UACTU: CAP SMD 0603; Manufacturer_Name: Kemet; Datasheet Link: https://componentsearchengine.com/Datasheets/1/C1206C104Z5UACTU.pdf; Height: 0.88mm; Manufacturer_Part_Number: C1206C104Z5UACTU; Mouser Part Number: 80-C1206C104Z5U; Mouser Price/Stock: https://www.mouser.com/Search/Refine.aspx?Keyword=80-C1206C104Z5U
D2 D5 = TBU-CA065-200-WH: TVS Diode (Bi-directional); Manufacturer_Name: Bourns; Datasheet Link: https://www.bourns.com/data/global/pdfs/TBU-CA.pdf; Height: 1mm; Manufacturer_Part_Number: TBU-CA065-200-WH; Mouser Part Number: 652-TBU-CA065-200-WH; Mouser Price/Stock: https://www.mouser.co.uk/ProductDetail/Bourns/TBU-CA065-200-WH?qs=kLtMOTa49OkdVs42fYbv8A%3D%3D; Arrow Part Number: TBU-CA065-200-WH; Arrow Price/Stock: https://www.arrow.com/en/products/tbu-ca065-200-wh/bourns?region=nac
D3 D4 = SMBJ12CA: TVS DIODE 12V 19.9V SMB; Manufacturer: AVX Corporation; Bidirectional Channels: 1; Current - Peak Pulse (10/1000µs): 30.15A; Power Line Protection: No; Power - Peak Pulse: 600W; Type: Zener; Voltage - Breakdown (Min): 13.3V; Part Number: SMBJ12CA; Applications: General Purpose; ComponentLink1Description: Datasheet; ComponentLink1URL: //media.digikey.com/pdf/Data%20Sheets/AVX%20PDFs/Transient%20Suppression%20Diodes.pdf; ComponentLink2Description: DigiKey Link; ComponentLink2URL: http://digikey.com/product-detail/en/avx-corporation/SMBJ12CA/478-7062-1-ND/3340353; LastUpdated: 9/2/2020 1:28:17 AM; Lifecycle Status: Active; Minimum Order: 1; Mounting Type: Surface Mount; Operating Temperature: -55°C ~ 150°C (TJ); Package / Case: DO-214AA, SMB; Packaging: TapeAndReel; PartId: 9012; Part Status: Active; Price: 0.16; Series: -; Supplier 1: DigiKey; Supplier Part Number 1: 478-7062-1-ND; Supplier Device Package: SMB; Voltage - Clamping (Max) @ Ipp: 19.9V; Voltage - Reverse Standoff (Typ): 12V
F1 F2 = 1206SFS200F_63-2: Fuse 1206; Manufacturer_Name: TE Connectivity; Manufacturer_Part_Number: 1206SFS200F/63-2; Datasheet Link: http://docs-emea.rs-online.com/webdocs/13b6/0900766b813b6e27.pdf; Height: 1.17mm
GDT1 GDT2 = 2031-15T-SM-RPLF: Gas Discharge Tube SMD; Package: None; Price: None; Value: *; MP: 2031-15T-SM-RPLF; Availability: Unavailable
I1 = B2B-XH: XH 2pin standing
R16-R21 = CRCW080510K0JNEAIF: RES SMD 0603; Manufacturer: Vishay Dale; Power (Watts): 0.125W, 1/8W; Resistance: 10 kOhms; Temperature Coefficient: ±200ppm/°C; Tolerance: ±5%; Part Number: CRCW080510K0JNEAIF; ComponentLink1Description: Datasheet; ComponentLink1URL: http://www.vishay.com/docs/20024/dcrcwife3.pdf; ComponentLink2Description: DigiKey Link; ComponentLink2URL: http://digikey.com/product-detail/en/vishay-dale/CRCW080510K0JNEAIF/541-10KAPCT-ND/3477322; Composition: Thick Film; Device Package: 0805 (2012 Metric); Features: Automotive AEC-Q200, Pulse Withstanding; Height - Seated (Max): 0.020" (0.50mm); LastUpdated: 9/2/2020 1:14:55 AM; Lifecycle Status: Active; Minimum Order: 1; Number of Terminations: 2; Operating Temperature: -55°C ~ 155°C; Package / Case: 0805 (2012 Metric); Packaging: TapeAndReel; PartId: 40891; Part Status: Active; Price: 0.08; Ratings: AEC-Q200; Series: CRCW-IF; Size / Dimension: 0.079" L x 0.049" W (2.00mm x 1.25mm); Supplier 1: DigiKey; Supplier Part Number 1: 541-10KAPCT-ND; Supplier Device Package: 0805
  R16 R17 R19: Value: 200
  R18: Value: 120R
  R20 R21: Value: 4.7K
RS1 RS2 = B4B-XH: XH 4pin standing
U3 = ADM4850ARZ: MAX485 SMD; Manufacturer_Name: Analog Devices; Datasheet Link: http://www.analog.com/static/imported-files/data_sheets/ADM4850_4851_4852_4853_4854_4855_4856_4857.pdf; Height: 1.75mm; Manufacturer_Part_Number: ADM4850ARZ; Mouser Part Number: 584-ADM4850ARZ; Mouser Price/Stock: https://www.mouser.com/Search/Refine.aspx?Keyword=584-ADM4850ARZ; Arrow Part Number: ADM4850ARZ; Arrow Price/Stock: https://www.arrow.com/en/products/adm4850arz/analog-devices

## Sheet whte_noise.SchDoc
size A4
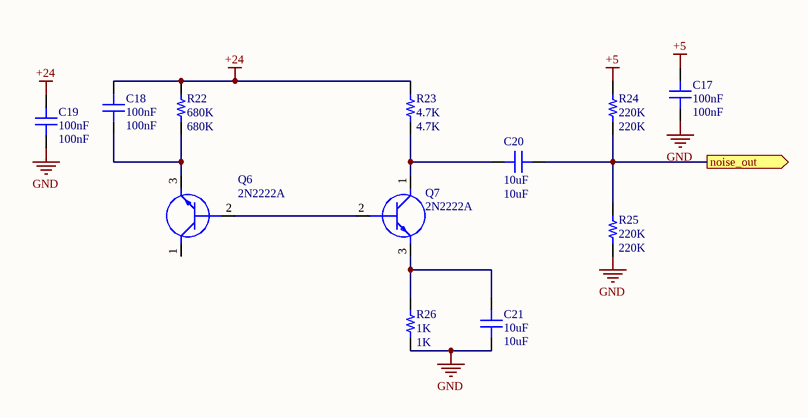
[diagram p4: whte_noise.SchDoc]

### Parts
C17  100nF  [cap805]
C18  100nF  [cap805]
C19  100nF  [cap805]
C20  10uF  [cap805]
C21  10uF  [cap805]
Q6  2N2222A  [soT95p280x130-3n]
Q7  2N2222A  [soT95p280x130-3n]
R22  680K  [0603R]
R23  4.7K  [0603R]
R24  220K  [0603R]
R25  220K  [0603R]
R26  1K  [0603R]

### Ports
noise_out (out)

### Nets
+5: C17.1 R24.2
+24: C18.2 C19.1 R22.2 R23.2
GND: C17.2 C19.2 C21.1 R25.1 R26.1
whitenoise: C20.1 R24.1 R25.2 ; port noise_out
NetC18_1: C18.1 Q6.3(E) R22.1
NetC20_2: C20.2 Q7.1(C) R23.1
NetC21_2: C21.2 Q7.3(E) R26.2
NetQ6_2: Q6.2(B) Q7.2(B)

Not connected (* = marked no-connect by the designer): Q6 1(C)

### Library data of the parts
C17-C21 = Capacitor: CAP SMD 0805; Part Number: C0805X106K9RAC7800
  C17-C19: Value: 100nF
  C20 C21: Value: 10uF
Q6 Q7 = 2N2222A: Transistor BJT NPN SMD; pin to pad: 1>3 2>1 3>2; Manufacturer_Name: Foshan Blue Rocket Elec; Datasheet Link: https://datasheet.lcsc.com/szlcsc/1901291437_Foshan-Blue-Rocket-Elec-2N2222A_C358533.pdf; Height: 4.7mm; Manufacturer_Part_Number: 2N2222A
R22-R26 = Resistor: as R10 on sheet micro
  R22: Value: 680K
  R23: Value: 4.7K
  R24 R25: Value: 220K
  R26: Value: 1K

## Sheet power.SchDoc
size A4
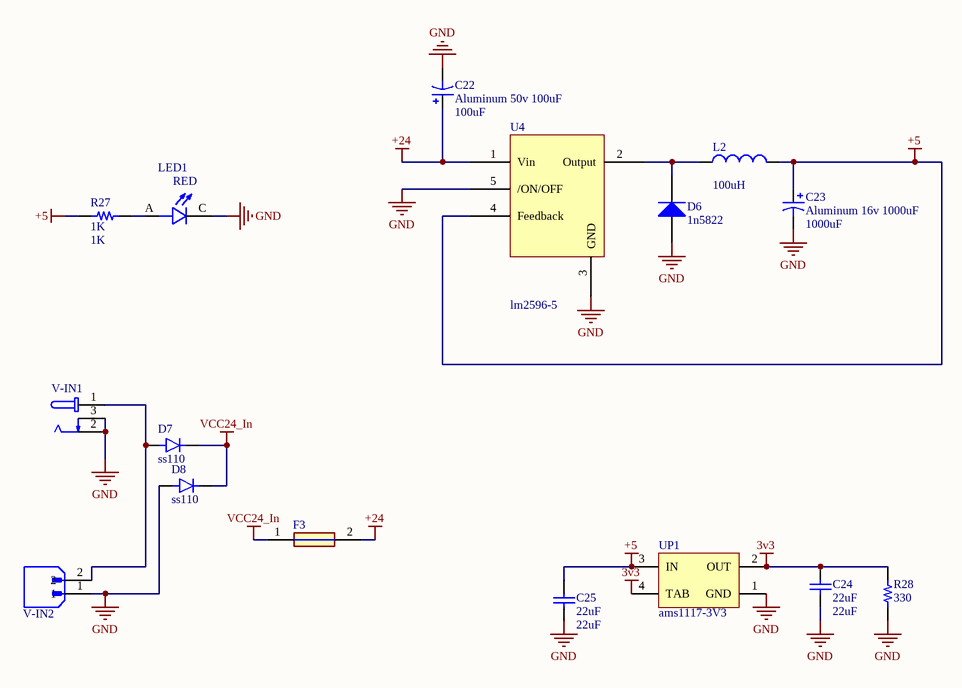
[diagram p5: power.SchDoc]

### Parts
C22  Aluminum 50v 100uF  value 100uF  [Cap SMD 100UF 35~50v]
C23  Aluminum 16v 1000uF  value 1000uF  [CAP SMD 1000UF 16V]
C24  22uF  [0603C]
C25  22uF  [0603C]
D6  1n5822  [SMA DIODE 2]
D7  ss110  [ss110]
D8  ss110  [ss110]
F3  fuse 2amp  [1206 FUSE]  (value not drawn)
L2  value 100uH  [inductor]  (hidden comment: inductor 100uH)
LED1  LED RED  [LED_7012X1]  (value not drawn)
R27  1K  [0603R]
R28  330  [0603R]
U4  lm2596-5  [2596]
UP1  ams1117-3V3  [SOT223]
V-IN1  DC jack power  [GCT_DCJ235-05-A-XX-X_REVA]  (value not drawn)
V-IN2  Phoenix  [AMPHENOL_OQ0271510000G]  (value not drawn)

### Nets
3v3: C24.2 R28.1 UP1.2(OUT) UP1.4(TAB)
+5: C23.1 C25.2 L2.2 R27.1 U4.4(Feedback) UP1.3(IN)
+24: C22.1 F3.2 U4.1(Vin)
GND: C22.2 C23.2 C24.1 C25.1 D6.1(A) D8.A LED1.C R28.2 U4.3(GND) U4.5(/ON/OFF) UP1.1(GND) V-IN1.2 V-IN1.3 V-IN2.1
VCC24_In: D7.C(K) D8.C(K) F3.1
NetD6_2: D6.2(K) L2.1 U4.2(Output)
NetD7_A: D7.A V-IN1.1 V-IN2.2
NetLED1_A: LED1.A R27.2

### Notes on the sheet
- (in symbol 7012X1) RED

### Library data of the parts
C22 C23 = Cap Pol1: CAP POLAR SMD; Published: 8-Jun-2000; LatestRevisionDate: 17-Jul-2002; LatestRevisionNote: Re-released for DXP Platform.; PackageReference: RB7.6-15; Publisher: Altium Limited; PackageDescription: Polarized Capacitor (Radial); 2 Leads
C24 C25 = Cap: CAP SMD 0603; Published: 8-Jun-2000; LatestRevisionDate: 17-Jul-2002; LatestRevisionNote: Re-released for DXP Platform.; PackageReference: RAD-0.3; Publisher: Altium Limited; PackageDescription: Radial Cap, Thru-Hole; 2 Leads; 0.3 in Pin Spacing; Value: 22uF
D6 = Diode 1N4007: 1 Amp schottky Diode SMA; Published: 8-Jun-2000; LatestRevisionDate: 17-Jul-2002; LatestRevisionNote: Re-released for DXP Platform.; DatasheetVersion: 1998; PackageVersion: Aug-1999; PackageReference: DO-41; Publisher: Altium Limited; PackageDescription: Diode, Axial; Body 5.2 x 2.7 mm (LxDia. max), Lead Dia. 0.86 mm (max); Code_JEDEC: DO-204-AL; ComponentLink1Description: Manufacturer Link; ComponentLink1URL: http://www.fairchildsemi.com/; ComponentLink2Description: Datasheet; ComponentLink2URL: http://www.fairchildsemi.com/ds/1N%2F1N4001.pdf
D7 D8 = SBR0560S1-7: Diode Super Barrier 60V 500mA Surface Mount SOD-123; MF: Diodes Inc.; MP: SBR0560S1-7; Availability: Unavailable; SnapEDA_Link: https://www.snapeda.com/parts/SBR0560S1-7/Diodes%20Inc./view-part/491648/?ref=snap; Package: SOD-123 Diodes Inc.; Value: *; Price: None
F3 = 1206SFS200F_63-2: as F1 on sheet RS485; Datasheet Link: http://docs-emea.rs-online.com/webdocs/13b6/0900766b813b6e27.pdf; Height: 1.17mm
L2 = Inductor: Inductor 12*12mm; Code_IEC: 1005; Published: 8-Jun-2000; LatestRevisionDate: 29-May-2009; LatestRevisionNote: IPC-7351 Footprint Added.; PackageReference: 0402-A; Publisher: Altium Limited; PackageDescription: Chip Inductor; Code_JEITA: 0402
LED1 = 7012X1: LED SMD 0805 RED; Package: None; Price: None; Value: *; MP: 7012X1; Availability: Unavailable
R27 R28 = Resistor: as R10 on sheet micro
  R27: Value: 1K
  R28: Value: 330
U4 = lm2596
UP1 = AMS1117-x.x: 3.3 Volt, 800mA SOT-223; Designer: Ali Hafizi; Data: 16-12-2016
V-IN1 = DCJ235-05-A-XX-X_REVA: Dc Power Jack on-board; MF: Global Connector Technology; MP: DCJ235-05-A-K1-A; Price: None; Availability: Unavailable; Package: None; SnapEDA_Link: https://www.snapeda.com/parts/DCJ235-05-A-K1-A/Global%20Connector%20Technology/view-part/813042/?ref=snap; Value: *
V-IN2 = OQ0271510000G: Phoenix Terminal Right 2PIN; MF: Amphenol Anytek; MP: OQ0271510000G; Value: *; Check_prices: https://www.snapeda.com/parts/OQ0271510000G/Amphenol/view-part/4075971/?ref=eda; SnapEDA_Link: https://www.snapeda.com/parts/OQ0271510000G/Amphenol/view-part/4075971/?ref=snap; Price: None; Availability: Warning; Purchase-URL: https://pricing.snapeda.com/search/part/OQ0271510000G/?ref=eda; Package: None

## Sheet indicators.SchDoc
size A4
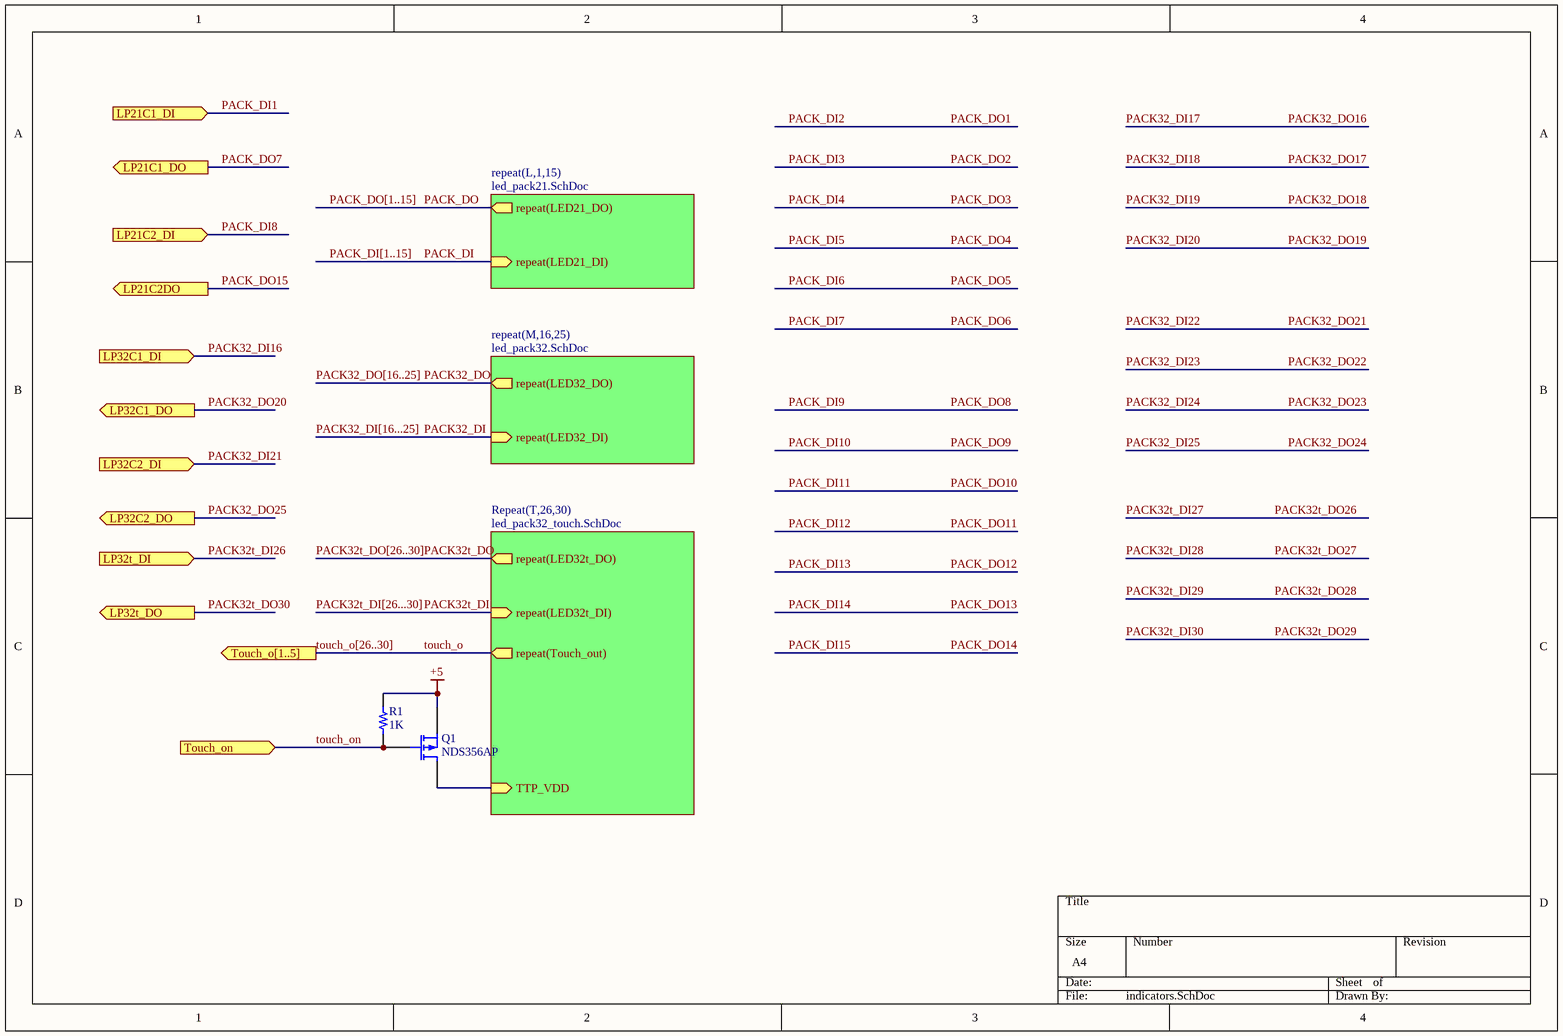
[diagram p6: indicators.SchDoc]

### Parts
Q1  NDS356AP  [soT95p280x130-3n]
R1  1K  [0603R]

### Sub-sheets
repeat(L,1,15) = led_pack21.SchDoc: repeat(LED21_DO) (out), repeat(LED21_DI) (in)
repeat(M,16,25) = led_pack32.SchDoc: repeat(LED32_DO) (out), repeat(LED32_DI) (in)
Repeat(T,26,30) = led_pack32_touch.SchDoc: TTP_VDD (in), repeat(Touch_out) (out), repeat(LED32t_DO) (out), repeat(LED32t_DI) (in)

### Ports
LP21C1_DI (in), LP21C1_DO (out), LP21C2_DI (in), LP21C2DO (out), LP32C1_DI (in), LP32C1_DO (out), LP32C2_DI (in), LP32C2_DO (out), LP32t_DI (in), LP32t_DO (out), Touch_o[1..5] (out), Touch_on (in)

### Nets
+5: Q1.3(S) R1.1
PACK32_DI: sheet repeat(M,16,25)/repeat(LED32_DI)
PACK32_DO: sheet repeat(M,16,25)/repeat(LED32_DO)
PACK32t_DI: sheet Repeat(T,26,30)/repeat(LED32t_DI)
PACK32t_DO: sheet Repeat(T,26,30)/repeat(LED32t_DO)
PACK_DI: sheet repeat(L,1,15)/repeat(LED21_DI)
PACK_DO: sheet repeat(L,1,15)/repeat(LED21_DO)
touch_o: sheet Repeat(T,26,30)/repeat(Touch_out)
touch_on: Q1.2(G) R1.2 ; port Touch_on
TTP_VDD: Q1.1(D) ; sheet Repeat(T,26,30)/TTP_VDD

### Buses and harness runs
bus PACK32_DI[16...25]
bus PACK32_DO[16..25]
bus PACK32t_DI[26...30]
bus PACK32t_DO[26..30]
bus PACK_DI[1..15]
bus PACK_DO[1..15]
bus touch_o[26..30] = port Touch_o[1..5]

### Library data of the parts
Q1 = MOSFET-P: P-Channel MOSFET SOT23; pin to pad: 1>3 2>1 3>2; Published: 8-Jun-2000; LatestRevisionDate: 17-Jul-2002; LatestRevisionNote: Re-released for DXP Platform.; PackageVersion: 1995/1996; PackageReference: E3; Publisher: Altium Limited; PackageDescription: TO, Flat Index; 3 In-Line, Axial Leads; Body Dia. 4.6mm; Lead Dia. 0.5 mm (max)
R1 = Resistor: as R10 on sheet micro; Value: 1K

## Sheet led_pack21.SchDoc
size A4
Used 15 times, as channels U_indicators/L1, U_indicators/L2, U_indicators/L3, U_indicators/L4, U_indicators/L5, U_indicators/L6, U_indicators/L7, U_indicators/L8, U_indicators/L9, U_indicators/L10, U_indicators/L11, U_indicators/L12, U_indicators/L13, U_indicators/L14, U_indicators/L15. Parts and nets are listed once, with the designators drawn on the sheet.
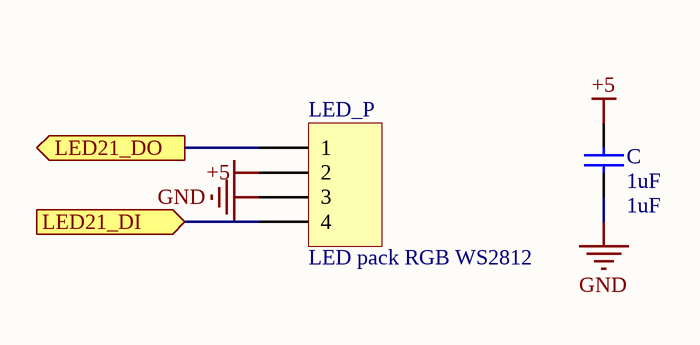
[diagram p7: led_pack21.SchDoc]

### Parts
C  1uF  [0603C]
LED_P  LED pack RGB WS2812  [pack21-2121]  (no BOM)

### Ports
LED21_DI (in), LED21_DO (out)

### Nets
+5: C.2 LED_P.2
GND: C.1 LED_P.3
LED21_DI: LED_P.4 ; port LED21_DI
LED21_DO: LED_P.1 ; port LED21_DO

### Channels
U_indicators/L1: designators end in _L1; ports LED21_DI=LED_D4 LED21_DO=PACK_DI2
U_indicators/L2: designators end in _L2; ports LED21_DI=PACK_DI2 LED21_DO=PACK_DI3
U_indicators/L3: designators end in _L3; ports LED21_DI=PACK_DI3 LED21_DO=PACK_DI4
U_indicators/L4: designators end in _L4; ports LED21_DI=PACK_DI4 LED21_DO=PACK_DI5
U_indicators/L5: designators end in _L5; ports LED21_DI=PACK_DI5 LED21_DO=PACK_DI6
U_indicators/L6: designators end in _L6; ports LED21_DI=PACK_DI6 LED21_DO=PACK_DI7
U_indicators/L7: designators end in _L7; ports LED21_DI=PACK_DI7 LED21_DO=PACK_DO7
U_indicators/L8: designators end in _L8; ports LED21_DI=LED_D5 LED21_DO=PACK_DI9
U_indicators/L9: designators end in _L9; ports LED21_DI=PACK_DI9 LED21_DO=PACK_DI10
U_indicators/L10: designators end in _L10; ports LED21_DI=PACK_DI10 LED21_DO=PACK_DI11
U_indicators/L11: designators end in _L11; ports LED21_DI=PACK_DI11 LED21_DO=PACK_DI12
U_indicators/L12: designators end in _L12; ports LED21_DI=PACK_DI12 LED21_DO=PACK_DI13
U_indicators/L13: designators end in _L13; ports LED21_DI=PACK_DI13 LED21_DO=PACK_DI14
U_indicators/L14: designators end in _L14; ports LED21_DI=PACK_DI14 LED21_DO=PACK_DI15
U_indicators/L15: designators end in _L15; ports LED21_DI=PACK_DI15 LED21_DO=PACK_DO15

### Library data of the parts
C = Cap: CAP SMD 0603; Published: 8-Jun-2000; LatestRevisionDate: 17-Jul-2002; LatestRevisionNote: Re-released for DXP Platform.; PackageReference: RAD-0.3; Publisher: Altium Limited; PackageDescription: Radial Cap, Thru-Hole; 2 Leads; 0.3 in Pin Spacing; Value: 1uF
LED_P = Header 4: 5 RGB LED pack; LatestRevisionDate: 17-Jul-2002; LatestRevisionNote: Re-released for DXP Platform.; Publisher: Altium Limited

## Sheet led_pack32.SchDoc
size A4
Used 10 times, as channels U_indicators/M16, U_indicators/M17, U_indicators/M18, U_indicators/M19, U_indicators/M20, U_indicators/M21, U_indicators/M22, U_indicators/M23, U_indicators/M24, U_indicators/M25. Parts and nets are listed once, with the designators drawn on the sheet.
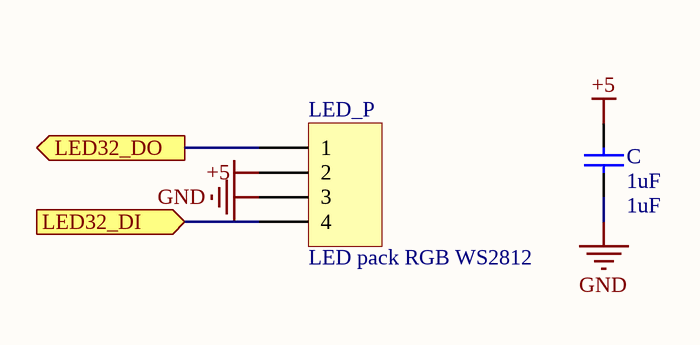
[diagram p8: led_pack32.SchDoc]

### Parts
C  1uF  [0603C]
LED_P  LED pack RGB WS2812  [PACK32-2121]  (no BOM)

### Ports
LED32_DI (in), LED32_DO (out)

### Nets
+5: C.2 LED_P.2
GND: C.1 LED_P.3
LED32_DI: LED_P.4 ; port LED32_DI
LED32_DO: LED_P.1 ; port LED32_DO

### Channels
U_indicators/M16: designators end in _M16; ports LED32_DI=LED_D1 LED32_DO=PACK32_DI17
U_indicators/M17: designators end in _M17; ports LED32_DI=PACK32_DI17 LED32_DO=PACK32_DI18
U_indicators/M18: designators end in _M18; ports LED32_DI=PACK32_DI18 LED32_DO=PACK32_DI19
U_indicators/M19: designators end in _M19; ports LED32_DI=PACK32_DI19 LED32_DO=PACK32_DI20
U_indicators/M20: designators end in _M20; ports LED32_DI=PACK32_DI20 LED32_DO=PACK32_DO20
U_indicators/M21: designators end in _M21; ports LED32_DI=LED_D2 LED32_DO=PACK32_DI22
U_indicators/M22: designators end in _M22; ports LED32_DI=PACK32_DI22 LED32_DO=PACK32_DI23
U_indicators/M23: designators end in _M23; ports LED32_DI=PACK32_DI23 LED32_DO=PACK32_DI24
U_indicators/M24: designators end in _M24; ports LED32_DI=PACK32_DI24 LED32_DO=PACK32_DI25
U_indicators/M25: designators end in _M25; ports LED32_DI=PACK32_DI25 LED32_DO=PACK32_DO25

### Library data of the parts
C = Cap: CAP SMD 0603; Published: 8-Jun-2000; LatestRevisionDate: 17-Jul-2002; LatestRevisionNote: Re-released for DXP Platform.; PackageReference: RAD-0.3; Publisher: Altium Limited; PackageDescription: Radial Cap, Thru-Hole; 2 Leads; 0.3 in Pin Spacing; Value: 1uF
LED_P = Header 4: 8RGB LED pack; LatestRevisionDate: 17-Jul-2002; LatestRevisionNote: Re-released for DXP Platform.; Publisher: Altium Limited

## Sheet led_pack32_touch.SchDoc
size A4
Used 5 times, as channels U_indicators/T26, U_indicators/T27, U_indicators/T28, U_indicators/T29, U_indicators/T30. Parts and nets are listed once, with the designators drawn on the sheet.
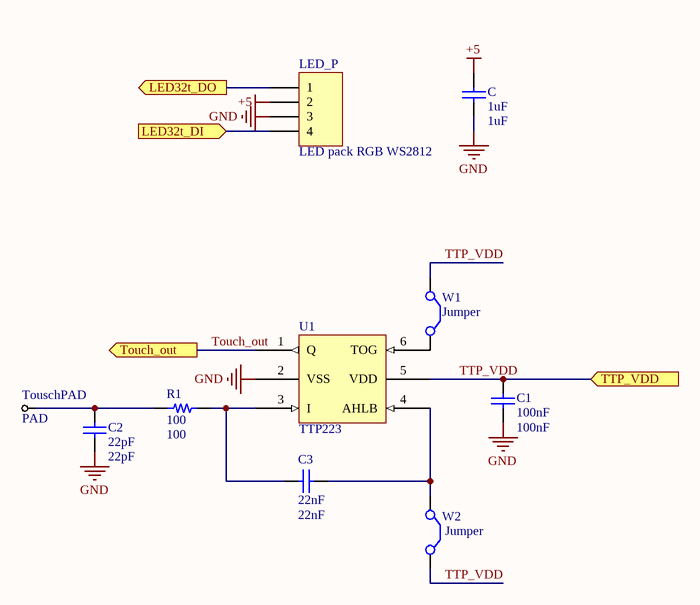
[diagram p9: led_pack32_touch.SchDoc]

### Parts
C  1uF  [0603C]
C1  100nF  [0603C]
C2  22pF  [0603C]
C3  22nF  [0603C]
LED_P  LED pack RGB WS2812  [PACK32-2121]  (no BOM)
PAD  TouschPAD  [touchPAD4]  (no BOM)
R1  100  [0603R]
U1  TTP223  [SOT23-6_L]
W1  Jumper  [JUMPER]  (no BOM)
W2  Jumper  [JUMPER]  (no BOM)

### Ports
LED32t_DI (in), LED32t_DO (out), Touch_out (out), TTP_VDD (in)

### Nets
+5: C.2 LED_P.2
GND: C.1 C1.1 C2.1 LED_P.3 U1.2(VSS)
LED32t_DI: LED_P.4 ; port LED32t_DI
LED32t_DO: LED_P.1 ; port LED32t_DO
Touch_out: U1.1(Q) ; port Touch_out
TTP_VDD: C1.2 U1.5(VDD) W1.1(C1) W2.2(C2) ; port TTP_VDD
NetC2_2: C2.2 PAD.1(T) R1.2
NetC3_1: C3.1 U1.4(AHLB) W2.1(C1)
NetC3_2: C3.2 R1.1 U1.3(I)
NetU1_6: U1.6(TOG) W1.2(C2)

### Channels
U_indicators/T26: designators end in _T26; ports LED32t_DI=LED_D3 LED32t_DO=PACK32t_DI27 Touch_out=touch1 TTP_VDD=TTP_VDD
U_indicators/T27: designators end in _T27; ports LED32t_DI=PACK32t_DI27 LED32t_DO=PACK32t_DI28 Touch_out=touch2 TTP_VDD=TTP_VDD
U_indicators/T28: designators end in _T28; ports LED32t_DI=PACK32t_DI28 LED32t_DO=PACK32t_DI29 Touch_out=touch3 TTP_VDD=TTP_VDD
U_indicators/T29: designators end in _T29; ports LED32t_DI=PACK32t_DI29 LED32t_DO=PACK32t_DI30 Touch_out=touch4 TTP_VDD=TTP_VDD
U_indicators/T30: designators end in _T30; ports LED32t_DI=PACK32t_DI30 LED32t_DO=PACK32t_DO30 Touch_out=touch5 TTP_VDD=TTP_VDD

### Library data of the parts
C C1 = Cap: CAP SMD 0603; Published: 8-Jun-2000; LatestRevisionDate: 17-Jul-2002; LatestRevisionNote: Re-released for DXP Platform.; PackageReference: RAD-0.3; Publisher: Altium Limited; PackageDescription: Radial Cap, Thru-Hole; 2 Leads; 0.3 in Pin Spacing
  C: Value: 1uF
  C1: Value: 100nF
C2 C3 = Cap: X7R_NPO; Published: 8-Jun-2000; LatestRevisionDate: 17-Jul-2002; LatestRevisionNote: Re-released for DXP Platform.; PackageReference: RAD-0.3; Publisher: Altium Limited; PackageDescription: Radial Cap, Thru-Hole; 2 Leads; 0.3 in Pin Spacing
  C2: Value: 22pF
  C3: Value: 22nF
LED_P = Header 4: 8 32mm RGB LED pack; LatestRevisionDate: 17-Jul-2002; LatestRevisionNote: Re-released for DXP Platform.; Publisher: Altium Limited
PAD = Test Point
R1 = Resistor: as R10 on sheet micro; Value: 100
U1 = ttp223b: capacitive touch IC
W1 W2 = Jumper: Jumper Wire; Published: 24-Mar-1999; LatestRevisionDate: 17-Jul-2002; LatestRevisionNote: Re-released for DXP Platform.; PackageReference: RAD-0.2; Publisher: Altium Limited; PackageDescription: Radial Cap, Thru-Hole; 2 Leads; 0.2 in Pin Spacing

## Nets that join several sheets
3v3: devices (5 pins), power (C24.2 R28.1 UP1.2 UP1.4)
+5: micro (15 pins), devices (17 pins), RS485 (5 pins), whte_noise (C17.1 R24.2), power (6 pins), indicators (Q1.3 R1.1), U_indicators/L1 (C_L1.2 LED_P_L1.2), U_indicators/L2 (C_L2.2 LED_P_L2.2), U_indicators/L3 (C_L3.2 LED_P_L3.2), U_indicators/L4 (C_L4.2 LED_P_L4.2), U_indicators/L5 (C_L5.2 LED_P_L5.2), U_indicators/L6 (C_L6.2 LED_P_L6.2), U_indicators/L7 (C_L7.2 LED_P_L7.2), U_indicators/L8 (C_L8.2 LED_P_L8.2), U_indicators/L9 (C_L9.2 LED_P_L9.2), U_indicators/L10 (C_L10.2 LED_P_L10.2), U_indicators/L11 (C_L11.2 LED_P_L11.2), U_indicators/L12 (C_L12.2 LED_P_L12.2), U_indicators/L13 (C_L13.2 LED_P_L13.2), U_indicators/L14 (C_L14.2 LED_P_L14.2), U_indicators/L15 (C_L15.2 LED_P_L15.2), U_indicators/M16 (C_M16.2 LED_P_M16.2), U_indicators/M17 (C_M17.2 LED_P_M17.2), U_indicators/M18 (C_M18.2 LED_P_M18.2), U_indicators/M19 (C_M19.2 LED_P_M19.2), U_indicators/M20 (C_M20.2 LED_P_M20.2), U_indicators/M21 (C_M21.2 LED_P_M21.2), U_indicators/M22 (C_M22.2 LED_P_M22.2), U_indicators/M23 (C_M23.2 LED_P_M23.2), U_indicators/M24 (C_M24.2 LED_P_M24.2), U_indicators/M25 (C_M25.2 LED_P_M25.2), U_indicators/T26 (C_T26.2 LED_P_T26.2), U_indicators/T27 (C_T27.2 LED_P_T27.2), U_indicators/T28 (C_T28.2 LED_P_T28.2), U_indicators/T29 (C_T29.2 LED_P_T29.2), U_indicators/T30 (C_T30.2 LED_P_T30.2)
+24: whte_noise (C18.2 C19.1 R22.2 R23.2), power (C22.1 F3.2 U4.1)
GND: micro (26 pins), devices (31 pins), RS485 (9 pins), whte_noise (5 pins), power (14 pins), U_indicators/L1 (C_L1.1 LED_P_L1.3), U_indicators/L2 (C_L2.1 LED_P_L2.3), U_indicators/L3 (C_L3.1 LED_P_L3.3), U_indicators/L4 (C_L4.1 LED_P_L4.3), U_indicators/L5 (C_L5.1 LED_P_L5.3), U_indicators/L6 (C_L6.1 LED_P_L6.3), U_indicators/L7 (C_L7.1 LED_P_L7.3), U_indicators/L8 (C_L8.1 LED_P_L8.3), U_indicators/L9 (C_L9.1 LED_P_L9.3), U_indicators/L10 (C_L10.1 LED_P_L10.3), U_indicators/L11 (C_L11.1 LED_P_L11.3), U_indicators/L12 (C_L12.1 LED_P_L12.3), U_indicators/L13 (C_L13.1 LED_P_L13.3), U_indicators/L14 (C_L14.1 LED_P_L14.3), U_indicators/L15 (C_L15.1 LED_P_L15.3), U_indicators/M16 (C_M16.1 LED_P_M16.3), U_indicators/M17 (C_M17.1 LED_P_M17.3), U_indicators/M18 (C_M18.1 LED_P_M18.3), U_indicators/M19 (C_M19.1 LED_P_M19.3), U_indicators/M20 (C_M20.1 LED_P_M20.3), U_indicators/M21 (C_M21.1 LED_P_M21.3), U_indicators/M22 (C_M22.1 LED_P_M22.3), U_indicators/M23 (C_M23.1 LED_P_M23.3), U_indicators/M24 (C_M24.1 LED_P_M24.3), U_indicators/M25 (C_M25.1 LED_P_M25.3), U_indicators/T26 (5 pins), U_indicators/T27 (5 pins), U_indicators/T28 (5 pins), U_indicators/T29 (5 pins), U_indicators/T30 (5 pins)
485en: micro (U2.54), RS485 (R17.2)
CS: micro (U2.15), devices (NRF1.4)
DS_1820_Q: micro (U2.50), devices (R43.1 U7.2)
DS_INT: micro (U2.42), devices (R29.1 U6.3)
LED_D1: micro (U2.72), U_indicators/M16 (LED_P_M16.4)
LED_D2: micro (U2.25), U_indicators/M21 (LED_P_M21.4)
LED_D3: micro (U2.23), U_indicators/T26 (LED_P_T26.4)
LED_D4: micro (U2.73), U_indicators/L1 (LED_P_L1.4)
LED_D5: micro (U2.24), U_indicators/L8 (LED_P_L8.4)
LED_D6: micro (U2.71), devices (LED_P1.4)
logo_touch: micro (U2.27), devices (U12.1)
MISO: micro (PP1.2 U2.22), devices (NRF1.7 rfid1.5)
MOSI: micro (PP1.1 U2.21), devices (NRF1.6 rfid1.6)
NetSP1_1: micro (U2.51), devices (SP1.1)
NRF_CE: micro (U2.16), devices (NRF1.3)
NRF_IRQ: micro (U2.17), devices (NRF1.8)
PACK32_DI17: U_indicators/M16 (LED_P_M16.1), U_indicators/M17 (LED_P_M17.4)
PACK32_DI18: U_indicators/M17 (LED_P_M17.1), U_indicators/M18 (LED_P_M18.4)
PACK32_DI19: U_indicators/M18 (LED_P_M18.1), U_indicators/M19 (LED_P_M19.4)
PACK32_DI20: U_indicators/M19 (LED_P_M19.1), U_indicators/M20 (LED_P_M20.4)
PACK32_DI22: U_indicators/M21 (LED_P_M21.1), U_indicators/M22 (LED_P_M22.4)
PACK32_DI23: U_indicators/M22 (LED_P_M22.1), U_indicators/M23 (LED_P_M23.4)
PACK32_DI24: U_indicators/M23 (LED_P_M23.1), U_indicators/M24 (LED_P_M24.4)
PACK32_DI25: U_indicators/M24 (LED_P_M24.1), U_indicators/M25 (LED_P_M25.4)
PACK32t_DI27: U_indicators/T26 (LED_P_T26.1), U_indicators/T27 (LED_P_T27.4)
PACK32t_DI28: U_indicators/T27 (LED_P_T27.1), U_indicators/T28 (LED_P_T28.4)
PACK32t_DI29: U_indicators/T28 (LED_P_T28.1), U_indicators/T29 (LED_P_T29.4)
PACK32t_DI30: U_indicators/T29 (LED_P_T29.1), U_indicators/T30 (LED_P_T30.4)
PACK_DI2: U_indicators/L1 (LED_P_L1.1), U_indicators/L2 (LED_P_L2.4)
PACK_DI3: U_indicators/L2 (LED_P_L2.1), U_indicators/L3 (LED_P_L3.4)
PACK_DI4: U_indicators/L3 (LED_P_L3.1), U_indicators/L4 (LED_P_L4.4)
PACK_DI5: U_indicators/L4 (LED_P_L4.1), U_indicators/L5 (LED_P_L5.4)
PACK_DI6: U_indicators/L5 (LED_P_L5.1), U_indicators/L6 (LED_P_L6.4)
PACK_DI7: U_indicators/L6 (LED_P_L6.1), U_indicators/L7 (LED_P_L7.4)
PACK_DI9: U_indicators/L8 (LED_P_L8.1), U_indicators/L9 (LED_P_L9.4)
PACK_DI10: U_indicators/L9 (LED_P_L9.1), U_indicators/L10 (LED_P_L10.4)
PACK_DI11: U_indicators/L10 (LED_P_L10.1), U_indicators/L11 (LED_P_L11.4)
PACK_DI12: U_indicators/L11 (LED_P_L11.1), U_indicators/L12 (LED_P_L12.4)
PACK_DI13: U_indicators/L12 (LED_P_L12.1), U_indicators/L13 (LED_P_L13.4)
PACK_DI14: U_indicators/L13 (LED_P_L13.1), U_indicators/L14 (LED_P_L14.4)
PACK_DI15: U_indicators/L14 (LED_P_L14.1), U_indicators/L15 (LED_P_L15.4)
photo: micro (U2.91), devices (LDR1.2 POT1.1 POT1.3)
RFID_CS: micro (U2.19), devices (rfid1.8)
RFID_RST: micro (U2.18), devices (rfid1.2)
RS48_busy: micro (D1.2 Q5.1 R13.2 U2.52), RS485 (RS1.1 RS2.1)
RX485: micro (U2.63), RS485 (R16.2)
SCK: micro (PP1.3 U2.20), devices (NRF1.5 rfid1.7)
SCL: micro (U2.43), devices (U6.16), RS485 (I1.1 R20.2)
SDA: micro (U2.44), devices (U6.15), RS485 (I1.2 R21.2)
touch1: micro (U2.78), U_indicators/T26 (U1_T26.1)
touch2: micro (U2.77), U_indicators/T27 (U1_T27.1)
touch3: micro (U2.76), U_indicators/T28 (U1_T28.1)
touch4: micro (U2.75), U_indicators/T29 (U1_T29.1)
touch5: micro (U2.74), U_indicators/T30 (U1_T30.1)
touch_logo_on: micro (U2.26), devices (Q2.2 R2.2)
touch_on: micro (U2.14), indicators (Q1.2 R1.2)
TTP_VDD: indicators (Q1.1), U_indicators/T26 (C1_T26.2 U1_T26.5 W1_T26.1 W2_T26.2), U_indicators/T27 (C1_T27.2 U1_T27.5 W1_T27.1 W2_T27.2), U_indicators/T28 (C1_T28.2 U1_T28.5 W1_T28.1 W2_T28.2), U_indicators/T29 (C1_T29.2 U1_T29.5 W1_T29.1 W2_T29.2), U_indicators/T30 (C1_T30.2 U1_T30.5 W1_T30.1 W2_T30.2)
TX485: micro (U2.64), RS485 (R19.2)
whitenoise: micro (U2.96), whte_noise (C20.1 R24.1 R25.2)